# EAGLE design ArticulatedPCBControlPower (EAGLE 9.6.2)
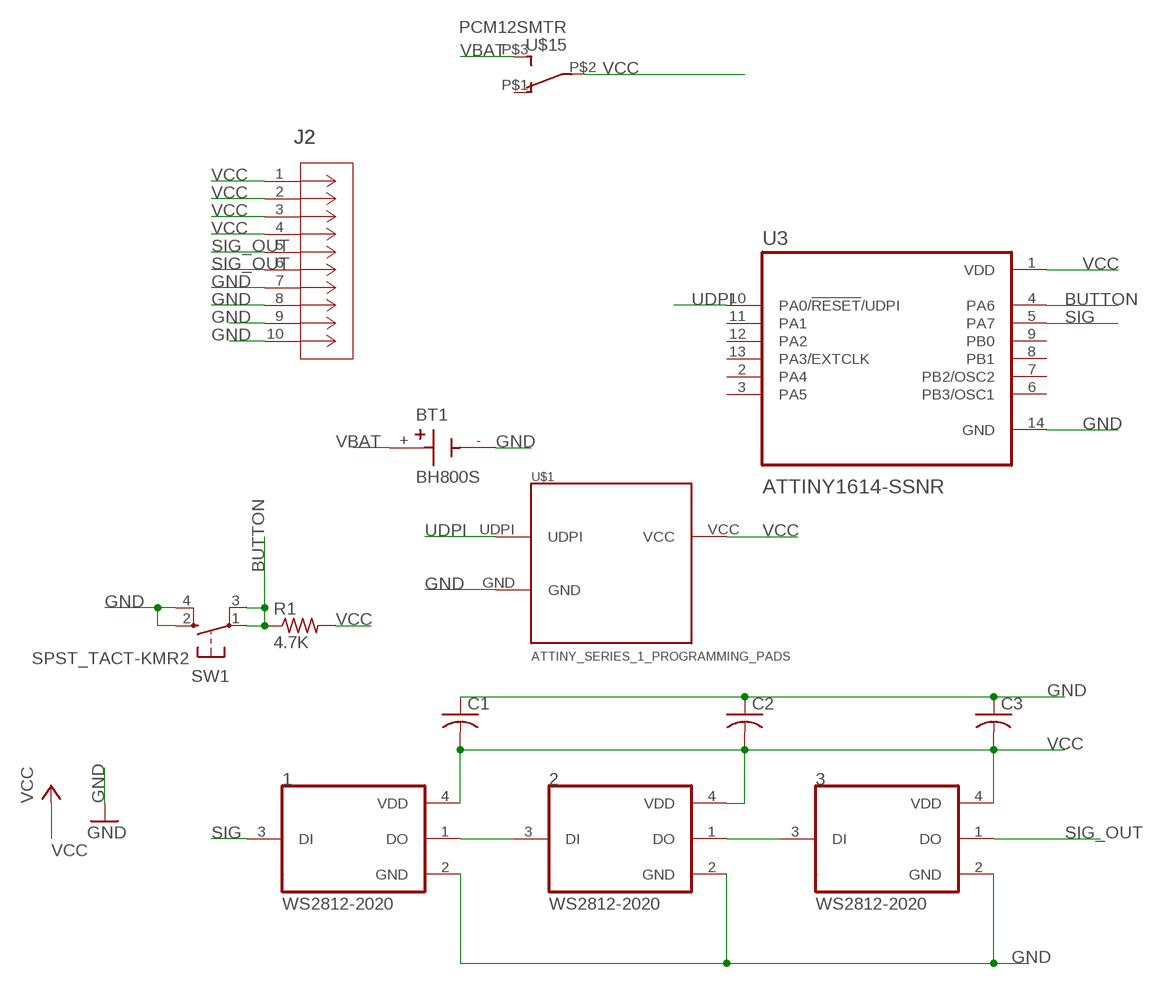
[diagram p0: schematic, sheet 1]

## Parts
1  WS2812-2020  [LED_WS2812-2020]
2  WS2812-2020  [LED_WS2812-2020]
3  WS2812-2020  [LED_WS2812-2020]
BT1  BH800S  [BAT_BH800S]
C1  C-USC0603  [C0603]
C2  C-USC0603  [C0603]
C3  C-USC0603  [C0603]
J2  DF23C-10DP-0.5V(92)  [CONN_DF23C-10DP-0.5V(92)_HIR]
R1  4.7K  R-US_R0603  [R0603]
SW1  SPST_TACT-KMR2  [KMR2]
U3  ATTINY1614-SSNR  [SOIC127P600X175-14N]
U$1  ATTINY_SERIES_1_PROGRAMMING_PADS  [ATTINY_SERIES_1_PROGRAMMING_PADS]
U$15  PCM12SMTR  [PCM12SMTR]

## Nets
BUTTON: R1.1 SW1.1(P) SW1.3(P1) U3.4(PA6)
GND: 1.2(GND) 2.2(GND) 3.2(GND) BT1.- C1.1 C2.1 C3.1 J2.7 J2.8 J2.9 J2.10 SW1.2(S) SW1.4(S1) U3.14(GND) U$1.GND
N$1: 1.1(DO) 2.3(DI)
N$4: 2.1(DO) 3.3(DI)
SIG: 1.3(DI) U3.5(PA7)
SIG_OUT: 3.1(DO) J2.5 J2.6
UDPI: U3.10(PA0/!RESET!/UDPI) U$1.UDPI
VBAT: BT1.+ U$15.P$3
VCC: 1.4(VDD) 2.4(VDD) 3.4(VDD) C1.2 C2.2 C3.2 J2.1 J2.2 J2.3 J2.4 R1.2 U3.1(VDD) U$1.VCC U$15.P$2
Unconnected: U3.2(PA4) U3.3(PA5) U3.6(PB3/OSC1) U3.7(PB2/OSC2) U3.8(PB1) U3.9(PB0) U3.11(PA1) U3.12(PA2) U3.13(PA3/EXTCLK) U$15.P$1

## Library data of the parts
1-3 = WS2812-2020:WS2812-2020: Intelligent control LED integrated light source; AVAILABILITY: Unavailable; MF: Worldsemi; MP: WS2812-2020; PACKAGE: Package Analog Devices; PRICE: None
BT1 = BH800S:BH800S: 2 CR2032 Holder; DESCRIPTION: Battery Holder (Open) Coin, 20.0mm 2 Cell PC Pin; DIGI-KEY_PART_NUMBER: BH800S-ABS-BULK-ND; MF: MPD; MP: BH800S; PACKAGE: None; PURCHASE-URL: https://pricing.snapeda.com/search/part/BH800S/?ref=eda
C1-C3 = adafruit:C-US: CAPACITOR, American symbol
J2 = debra:DF23C-10DP-0.5V(92); BUILT_BY: EMA_Cory; COPYRIGHT: Copyright (C) 2018 Accelerated Designs. All rights reserved; DATASHEET: https://www.hirose.com/product/download/?distributor=digikey&type=2d&lang=en&num=DF23C-10DP-0.5V(92); MANUFACTURER_PART_NUMBER: DF23C-10DP-0.5V(92); SOURCELIBRARY: Hirose_2020-05-07; VENDOR: Hirose
R1 = adafruit:R-US_: RESISTOR, American symbol
SW1 = adafruit:SPST_TACT: SMT 6mm switch, EVQQ2 series http://www.ladyada.net/library/eagle
U3 = ATTINY1614-SSNR:ATTINY1614-SSNR: 20MHz, SOIC, 85C, Green, 14 SOIC .150in T/R Buy Part <https://snapeda.com/parts/ATTINY1614-SSNR/Microchip%20Technology/view-part/?ref=eda>; ARROW_ELECTRONICS-PURCHASE-URL: https://snapeda.com/shop?store=Arrow+Electronics&id=4817174; AVAILABILITY: Good; DESCRIPTION: IC MCU 8BIT 16KB FLASH 14SOIC; MF: Microchip Technology; MOUSER-PURCHASE-URL: https://snapeda.com/shop?store=Mouser&id=4817174; MP: ATTINY1614-SSNR; PACKAGE: None; PRICE: None
U$1 = debra:ATTINY_SERIES_1_PROGRAMMING_PADS: Programming breakout pads for Series 1 Attiny chips
U$15 = StefansLib:PCM12SMTR

## Board
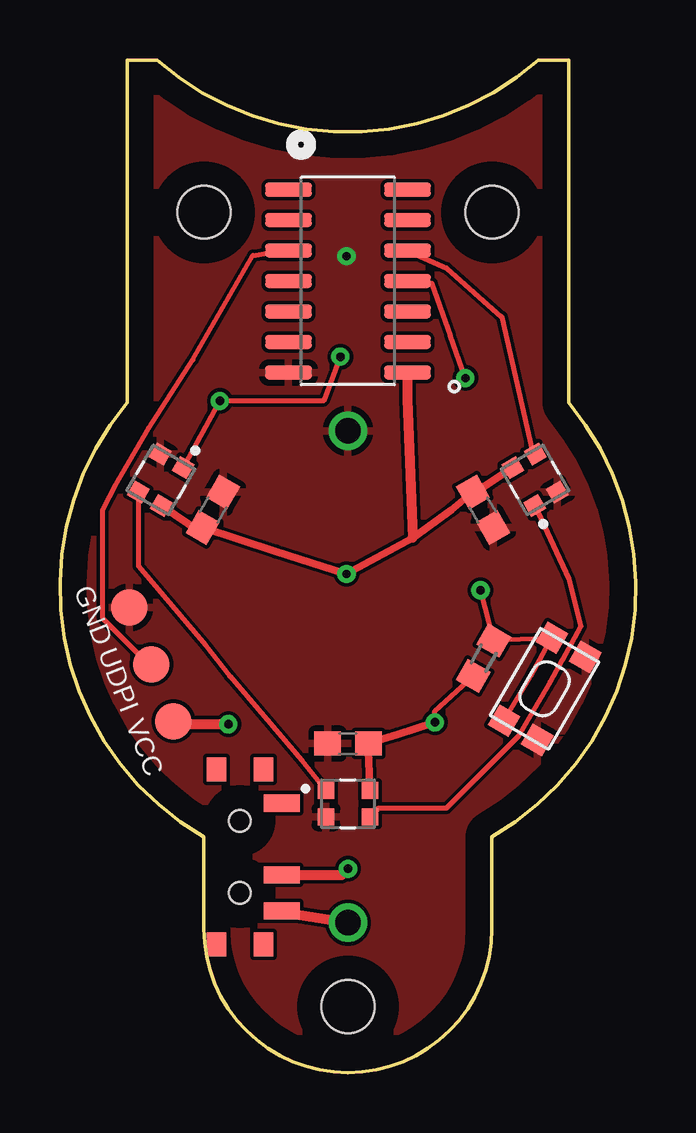
[diagram p1: board, top side]
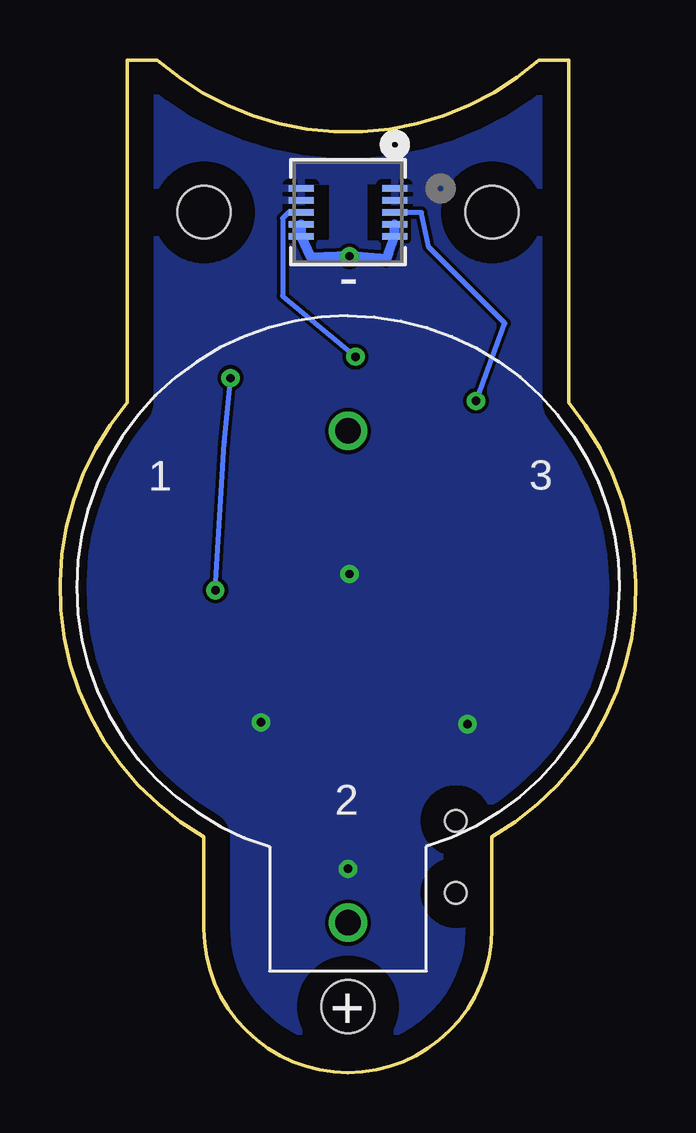
[diagram p2: board, bottom side, seen from below]

Size 24 x 42.21 mm. Coordinates in mm from the lower left corner, seen from the top.
Outline: 4.04,42.22 2.8,42.22 2.8,27.93 arc100 6,9.82 6,6 arc180 18,6 18,9.82 arc100 21.19,27.93 21.19,42.22 19.93,42.22 arc-83 4.04,42.22
Copper layers (1*16): Top 0.035mm / dielectric 1.5mm / Bottom 0.035mm
Design rules "default *": minimum track width 6mil, minimum drill 0.35mm, track to track 6mil, track to pad 6mil, pad to pad 6mil, via to via 6mil, smd to smd 6mil, copper to edge 40mil, drill to drill 6mil, minimum pad ring 6mil, minimum via ring 8mil, stop-mask expansion 4mil, vias tented up to drill 16mil, thermal gap 10mil
Holes 2.2 mm at 18,35.87 6,35.87 12,2.75

### Footprints (pad centres in the part's own frame; a part is rotated, then mirrored left to right if it is on the bottom)
LED_WS2812-2020 = smd 0.7 x 0.7: 1 -0.915,0.55; 2 -0.915,-0.55; 3 0.915,-0.55; 4 0.915,0.55
BAT_BH800S = drill 1.067: + 0,-14; - 0,6.5
C0603 = smd 1.1 x 1: 1 -0.85,0; 2 0.85,0
CONN_DF23C-10DP-0.5V(92)_HIR = smd 0.279 x 1.041: 1 -1,1.95; 2 -1,-1.95; 3 -0.5,1.95; 4 -0.5,-1.95; 5 0,1.95; 6 0,-1.95; 7 0.5,1.95; 8 0.5,-1.95; 9 1,1.95; 10 1,-1.95
R0603 = smd 1 x 1.1: 1 -0.85,0; 2 0.85,0
KMR2 = smd 1 x 1: 1 2,0.8; 2 2,-0.8; 3 -2,0.8; 4 -2,-0.8
SOIC127P600X175-14N = smd 1.95 x 0.59: 1 -2.48,3.81; 2 -2.48,2.54; 3 -2.48,1.27; 4 -2.48,0; 5 -2.48,-1.27; 6 -2.48,-2.54; 7 -2.48,-3.81; 8 2.48,-3.81; 9 2.48,-2.54; 10 2.48,-1.27; 11 2.48,0; 12 2.48,1.27; 13 2.48,2.54; 14 2.48,3.81
ATTINY_SERIES_1_PROGRAMMING_PADS = smd 1.524 x 1.524: GND 0,-2.54; UDPI 0,0; VCC 0,2.54
PCM12SMTR = smd 0.711 x 1.499: P$1 -2.235,1.74; P$2 0.762,1.74; P$3 2.261,1.74 | smd 0.991 x 0.813: P$10 -3.645,0.978; P$11 -3.645,-0.978; P$12 3.645,0.978; P$13 3.645,-0.978 | hole 0.9: -1.5,0; 1.5,0

### Placement (x,y rotation side)
1  19.79,24.71 120 top
2  12,11.21 0 top
3  4.2,24.71 240 top
BT1  12,20.25 0 bottom
C1  17.63,23.46 120 top
C2  12,13.71 0 top
C3  6.37,23.46 240 top
J2  12,35.87 270 bottom
R1  17.65,17.27 240 top
SW1  20.19,16 60 top
U3  12,33 180 top
U$1  3.81,17.02 201.2 top
U$15  7.5,9 270 top

### Tracks (layer width: path | path; a pad name or v marks a point on that pad's centre or on a via)
BUTTON  (via drill 0.35)
  Top 0.203: SW1.3 19.61,16.53 SW1.1 19.74,18.08 R1.1 v17.52,20.11 | v16.89,28.96 16.25,30.73 15.49,32.89 14.41,33 U3.4
  Bottom 0.203: v17.52,20.11 17.14,26.27 v16.89,28.96
GND  (via drill 0.35)
  Bottom 0.406: J2.7 J2.9 10.3,34.18 10.41,33.91 v11.94,34.04 13.52,33.98 J2.10 J2.8
  pour Top: -0.76,41.74 -0.76,-0.09 25.6,-0.09 25.6,41.74
N$1
  Top 0.203: 2.3 13.27,11.02 16.1,11.02 19.1,14.02 19.53,14.77 20.42,16.29 20.93,17.2 20.95,17.23 21.71,18.61 21.2,20.57 1.1
N$4
  Top 0.203: 2.1 10.08,13.02 7.07,16.53 6.07,17.81 3.27,21.11 3.3
SIG
  Top 0.203: U3.5 16.11,33.54 18.41,31.5 19.68,25.91 1.3
SIG_OUT  (via drill 0.35)
  Top 0.203: 3.1 v6.66,28 10.98,28 v11.68,29.84
  Bottom 0.203: J2.5 8.94,35.87 8.63,34.42 5.46,31.24 v6.66,28 | J2.6 14.47,35.87 14.72,35.61 14.72,32.38 v11.68,29.84
UDPI
  Top 0.203: U$1.UDPI 3.7,17.02 1.79,18.93 1.79,23.48 2.32,24.51 3.7,26.88 5.54,29.72 8.04,34.06 9.24,34.27 U3.10
VBAT
  Top 0.406: BT1.+ 11.65,6.25 11.43,6.35 9.85,6.61 9.72,6.74 U$15.P$3
VCC  (via drill 0.35)
  Top 0.203: v15.62,14.61 15.62,15.07 R1.2
  Top 0.305: 3.4 5.91,22.5 C3.2 8.99,21.73 v11.94,20.79 14.69,22.29 16.3,23.45 C1.2 17.33,24.2 18.49,24.98 18.73,25.11 1.4 | 2.4 12.91,12.02 12.85,13.42 C2.2 13.23,13.84 14.07,14.1 v15.62,14.61
  Top 0.406: U3.1 14.48,28.08 14.69,22.29 | v7.01,14.53 4.85,14.53 U$1.VCC | U$15.P$2 11.74,8.24 v12,8.5
  pour Bottom: -0.76,41.62 -0.76,-0.21 25.48,-0.21 25.48,41.74 -0.64,41.74